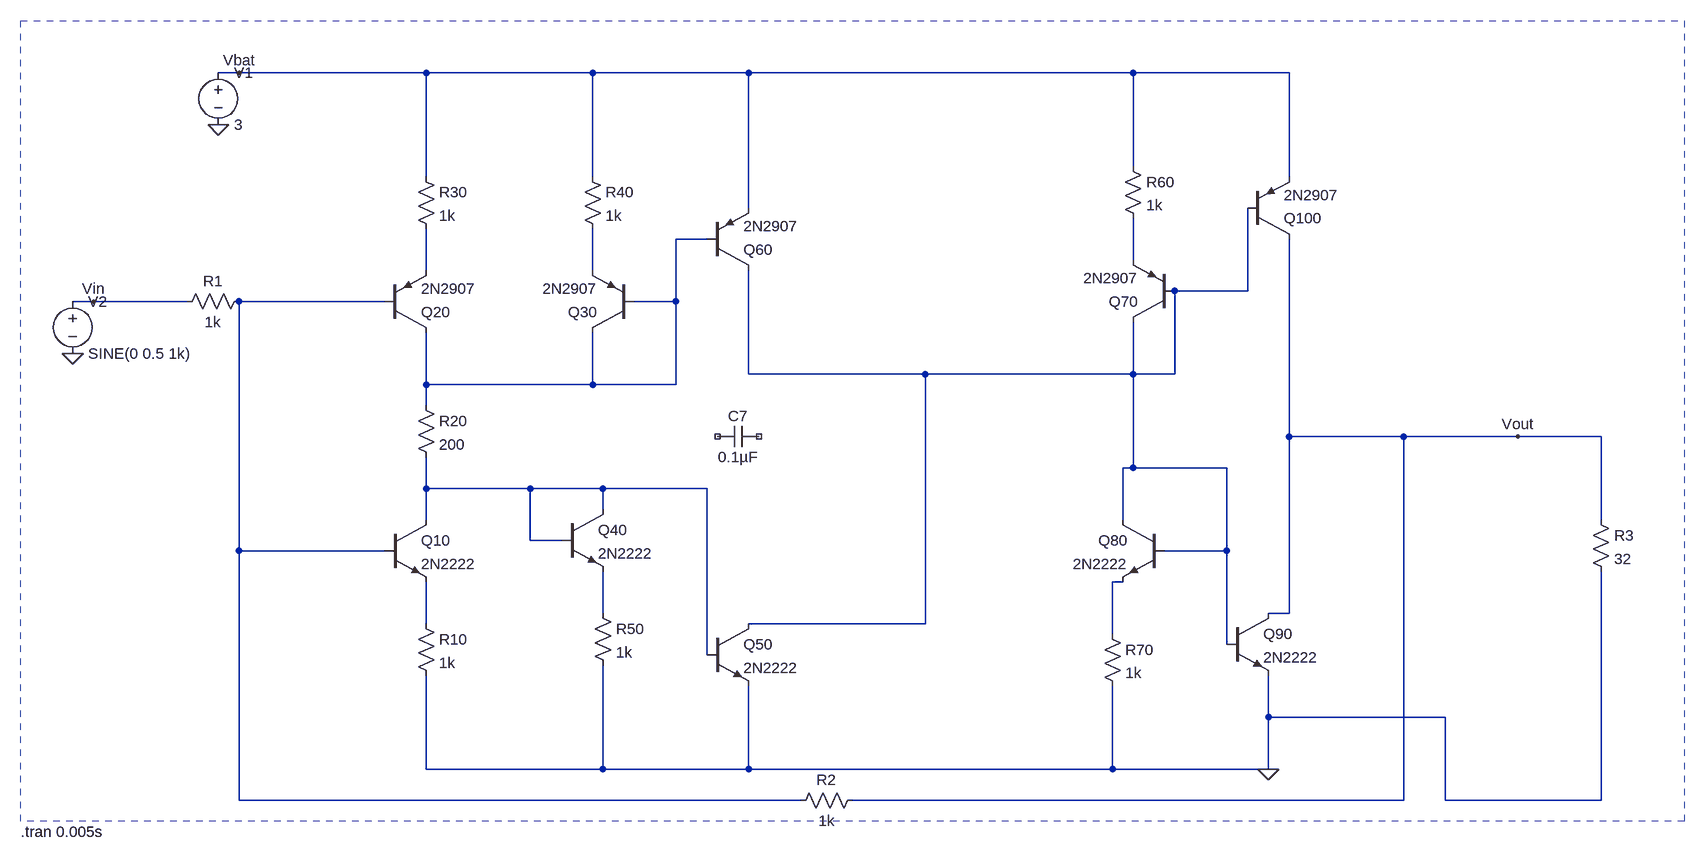
[diagram p0: schematic Power Amp.asc]
Power Amp.asc, the LTspice schematic file:
Version 4
SHEET 1 1428 680
WIRE -800 -576 -832 -576
WIRE -512 -576 -800 -576
WIRE -256 -576 -512 -576
WIRE -16 -576 -256 -576
WIRE 576 -576 -16 -576
WIRE 816 -576 576 -576
WIRE 576 -432 576 -576
WIRE -512 -416 -512 -576
WIRE -256 -416 -256 -576
WIRE 816 -416 816 -576
WIRE -16 -368 -16 -576
WIRE -80 -320 -128 -320
WIRE 576 -288 576 -352
WIRE -512 -272 -512 -336
WIRE -256 -272 -256 -336
WIRE 752 -240 752 -368
WIRE 752 -240 640 -240
WIRE -1024 -224 -1056 -224
WIRE -880 -224 -1024 -224
WIRE -576 -224 -800 -224
WIRE -128 -224 -128 -320
WIRE -128 -224 -192 -224
WIRE -16 -112 -16 -272
WIRE 256 -112 -16 -112
WIRE 576 -112 576 -192
WIRE 576 -112 256 -112
WIRE 640 -112 640 -240
WIRE 640 -112 576 -112
WIRE -512 -96 -512 -176
WIRE -256 -96 -256 -176
WIRE -256 -96 -512 -96
WIRE -128 -96 -128 -224
WIRE -128 -96 -256 -96
WIRE -512 -64 -512 -96
WIRE 816 -16 816 -320
WIRE 992 -16 816 -16
WIRE 1168 -16 992 -16
WIRE 1296 -16 1168 -16
WIRE 576 32 576 -112
WIRE 576 32 560 32
WIRE 720 32 576 32
WIRE -512 64 -512 16
WIRE -352 64 -512 64
WIRE -240 64 -352 64
WIRE -80 64 -240 64
WIRE -240 96 -240 64
WIRE -512 112 -512 64
WIRE 560 112 560 32
WIRE 1296 112 1296 -16
WIRE -352 144 -352 64
WIRE -304 144 -352 144
WIRE -800 160 -800 -224
WIRE -576 160 -800 160
WIRE 720 160 720 32
WIRE 720 160 624 160
WIRE 560 208 544 208
WIRE -240 256 -240 192
WIRE 816 256 816 -16
WIRE 816 256 784 256
WIRE -512 272 -512 208
WIRE 256 272 256 -112
WIRE 256 272 -16 272
WIRE 544 288 544 208
WIRE 720 304 720 160
WIRE -80 320 -80 64
WIRE 784 416 784 352
WIRE 1056 416 784 416
WIRE -512 496 -512 352
WIRE -240 496 -240 336
WIRE -240 496 -512 496
WIRE -16 496 -16 368
WIRE -16 496 -240 496
WIRE 544 496 544 368
WIRE 544 496 -16 496
WIRE 784 496 784 416
WIRE 784 496 544 496
WIRE -800 544 -800 160
WIRE 64 544 -800 544
WIRE 992 544 992 -16
WIRE 992 544 144 544
WIRE 1056 544 1056 416
WIRE 1296 544 1296 192
WIRE 1296 544 1056 544
FLAG 784 496 0
FLAG -1024 -224 Vin
FLAG -800 -576 Vbat
FLAG 1168 -16 Vout
FLAG -832 -496 0
FLAG -1056 -144 0
SYMBOL res -528 -432 R0
SYMATTR InstName R30
SYMATTR Value 1k
SYMBOL pnp -576 -176 M180
SYMATTR InstName Q20
SYMATTR Value 2N2907
SYMBOL pnp -192 -176 R180
SYMATTR InstName Q30
SYMATTR Value 2N2907
SYMBOL pnp -80 -272 M180
SYMATTR InstName Q60
SYMATTR Value 2N2907
SYMBOL pnp 640 -192 R180
SYMATTR InstName Q70
SYMATTR Value 2N2907
SYMBOL pnp 752 -320 M180
SYMATTR InstName Q100
SYMATTR Value 2N2907
SYMBOL res -528 -80 R0
SYMATTR InstName R20
SYMATTR Value 200
SYMBOL res -272 -432 R0
SYMATTR InstName R40
SYMATTR Value 1k
SYMBOL res 560 -448 R0
SYMATTR InstName R60
SYMATTR Value 1k
SYMBOL npn -576 112 R0
SYMATTR InstName Q10
SYMATTR Value 2N2222
SYMBOL npn -304 96 R0
SYMATTR InstName Q40
SYMATTR Value 2N2222
SYMBOL npn -80 272 R0
SYMATTR InstName Q50
SYMATTR Value 2N2222
SYMBOL npn 624 112 M0
SYMATTR InstName Q80
SYMATTR Value 2N2222
SYMBOL npn 720 256 R0
SYMATTR InstName Q90
SYMATTR Value 2N2222
SYMBOL res -528 256 R0
SYMATTR InstName R10
SYMATTR Value 1k
SYMBOL res -256 240 R0
SYMATTR InstName R50
SYMATTR Value 1k
SYMBOL res 528 272 R0
SYMATTR InstName R70
SYMATTR Value 1k
SYMBOL res -784 -240 R90
WINDOW 0 0 56 VBottom 2
WINDOW 3 32 56 VTop 2
SYMATTR InstName R1
SYMATTR Value 1k
SYMBOL cap 0 -32 R90
WINDOW 0 0 32 VBottom 2
WINDOW 3 32 32 VTop 2
SYMATTR InstName C7
SYMATTR Value 0.1µF
SYMBOL res 160 528 R90
WINDOW 0 0 56 VBottom 2
WINDOW 3 32 56 VTop 2
SYMATTR InstName R2
SYMATTR Value 1k
SYMBOL voltage -832 -592 R0
WINDOW 123 0 0 Left 0
WINDOW 39 0 0 Left 0
SYMATTR InstName V1
SYMATTR Value 3
SYMBOL voltage -1056 -240 R0
WINDOW 123 0 0 Left 0
WINDOW 39 0 0 Left 0
SYMATTR InstName V2
SYMATTR Value SINE(0 0.5 1k)
SYMBOL res 1280 96 R0
SYMATTR InstName R3
SYMATTR Value 32
TEXT -1136 592 Left 2 !.tran 0.005s
RECTANGLE Normal 1424 576 -1136 -656 2

The netlist it stands for:
* Power Amp.asc
R30 Vbat N003 1k
Q20 N001 N006 N003 0 2N2907
Q30 N001 N001 N004 0 2N2907
Q60 N005 N001 Vbat 0 2N2907
Q70 N005 N005 N002 0 2N2907
Q100 Vout N005 Vbat 0 2N2907
R20 N001 N007 200
R40 Vbat N004 1k
R60 Vbat N002 1k
Q10 N007 N006 N010 0 2N2222
Q40 N007 N007 N009 0 2N2222
Q50 N005 N007 0 0 2N2222
Q80 N005 N005 N008 0 2N2222
Q90 Vout N005 0 0 2N2222
R10 N010 0 1k
R50 N009 0 1k
R70 N008 0 1k
R1 N006 Vin 1k
C7 NC_01 NC_02 0.1µF
R2 Vout N006 1k
V1 Vbat 0 3
V2 Vin 0 SINE(0 0.5 1k)
R3 Vout 0 32
.model NPN NPN
.model PNP PNP
.lib standard.bjt
.tran 0.005s
.backanno
.end